# EAGLE schematic slave unit motherboard 1.31 (EAGLE 7.7.0)
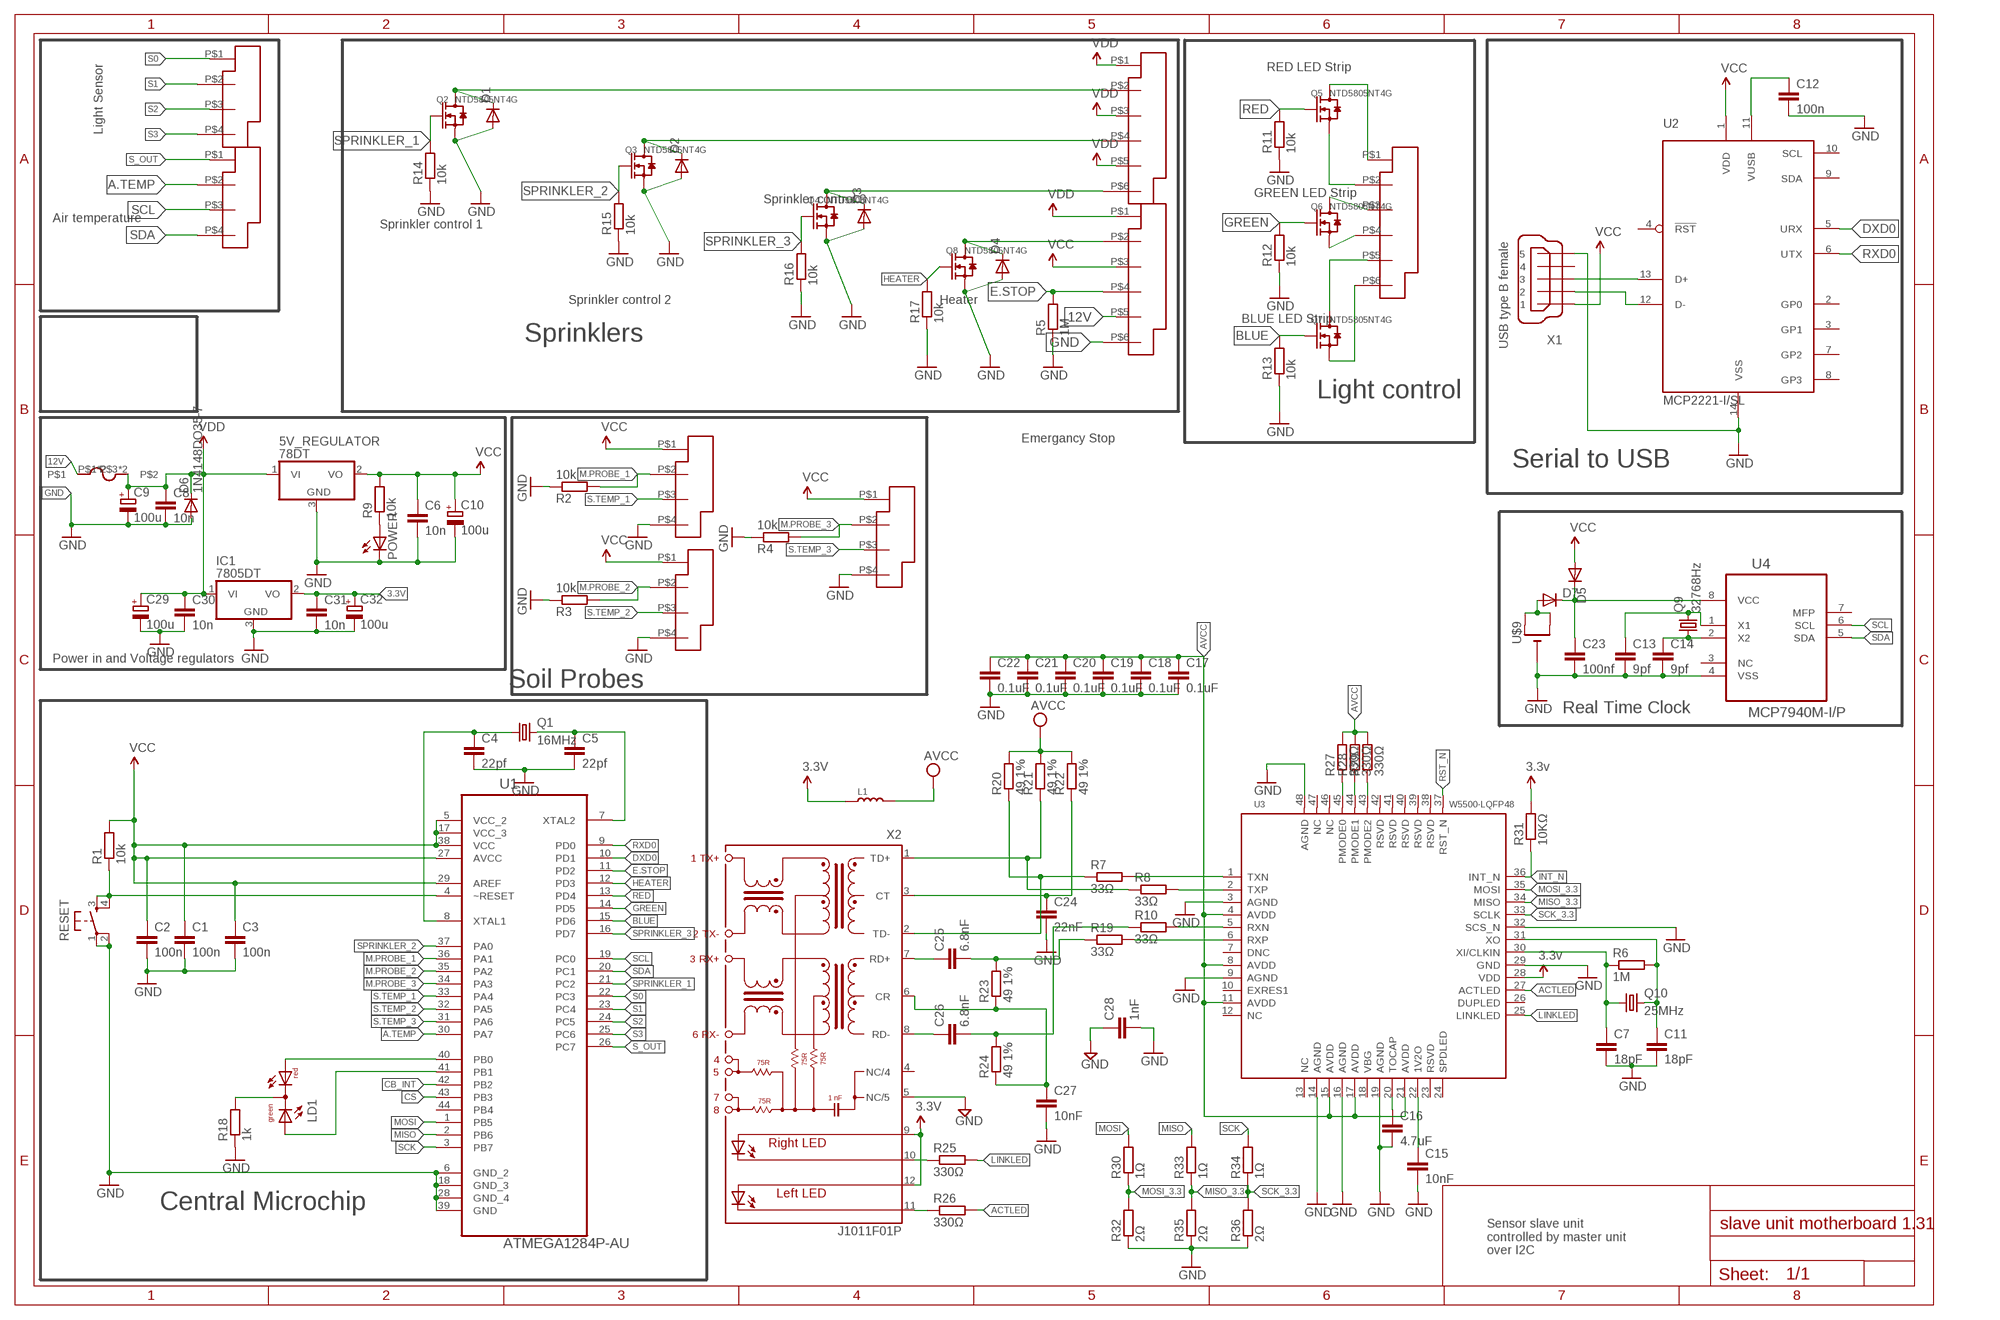
[diagram p0: schematic, sheet 1]

## Parts
5V_REGULATOR  78DT  7805DT  [TO252]
C1  100n  C-EUC0805  [C0805]
C2  100n  C-EUC0805  [C0805]
C3  100n  C-EUC0805  [C0805]
C4  22pf  C-EUC0805  [C0805]
C5  22pf  C-EUC0805  [C0805]
C6  10n  C-EUC0805  [C0805]
C7  18pF  C-EUC0805  [C0805]
C8  10n  C-EUC0805  [C0805]
C9  100u  CPOL-EUE1.8-4  [E1,8-4]
C10  100u  CPOL-EUE1.8-4  [E1,8-4]
C11  18pF  C-EUC0805  [C0805]
C12  100n  C-EUC0805  [C0805]
C13  9pf  C-EU025-024X044  [C025-024X044]
C14  9pf  C-EU025-024X044  [C025-024X044]
C15  10nF  C-EUC0805  [C0805]
C16  4.7uF  C-EUC0805  [C0805]
C17  0.1uF  C-EUC0805  [C0805]
C18  0.1uF  C-EUC0805  [C0805]
C19  0.1uF  C-EUC0805  [C0805]
C20  0.1uF  C-EUC0805  [C0805]
C21  0.1uF  C-EUC0805  [C0805]
C22  0.1uF  C-EUC0805  [C0805]
C23  100nf  C-EU025-024X044  [C025-024X044]
C24  22nF  C-EUC0805  [C0805]
C25  6.8nF  C-EUC0805  [C0805]
C26  6.8nF  C-EUC0805  [C0805]
C27  10nF  C-EUC0805  [C0805]
C28  1nF  C-EUC0805  [C0805]
C29  100u  CPOL-EUE1.8-4  [E1,8-4]
C30  10n  C-EUC0805  [C0805]
C31  10n  C-EUC0805  [C0805]
C32  100u  CPOL-EUE1.8-4  [E1,8-4]
D1  DIODE-MINIMELF  [MINIMELF]
D2  DIODE-MINIMELF  [MINIMELF]
D3  DIODE-MINIMELF  [MINIMELF]
D4  DIODE-MINIMELF  [MINIMELF]
D5  DIODE-D-2.5  [D-2.5]
D6  1N4148DO35-7  DIODE-MINIMELF  [MINIMELF]
D7  DIODE-D-2.5  [D-2.5]
IC1  7805DT  [TO252]
L1  INDUCTOR/FERRITE-BEAD'0805'  [L0805]
LD1  DUOLED-RG-C  [DUOLED-C-5MM]
LEDS1  3X2TERM  [3*2TERM]
POWER  LEDLD260  [LD260]
Q1  16MHz  CRYSTALS-NOGND-HC49  [HC49]
Q2  NTD5805NT4G  MOSFET-N  [SOT-23]
Q3  NTD5805NT4G  MOSFET-N  [SOT-23]
Q4  NTD5805NT4G  MOSFET-N  [SOT-23]
Q5  NTD5805NT4G  SMD-MOSFET-HIGH-POWER-N-CH-40V-51A-NTD5805NT4G(DPAK)  [DPAK]
Q6  NTD5805NT4G  SMD-MOSFET-HIGH-POWER-N-CH-40V-51A-NTD5805NT4G(DPAK)  [DPAK]
Q7  NTD5805NT4G  SMD-MOSFET-HIGH-POWER-N-CH-40V-51A-NTD5805NT4G(DPAK)  [DPAK]
Q8  NTD5805NT4G  MOSFET-N  [SOT-23]
Q9  32768Hz  CRYSTALTC26V  [TC26V]
Q10  25MHz  CRYSTALS-NOGND-HC49  [HC49]
R1  10k  R-EU_M0805  [M0805]
R2  10k  R-EU_M0805  [M0805]
R3  10k  R-EU_M0805  [M0805]
R4  10k  R-EU_M0805  [M0805]
R5  1M  R-EU_M0805  [M0805]
R6  1M  R-EU_M0805  [M0805]
R7  33Ω  R-EU_M0805  [M0805]
R8  33Ω  R-EU_M0805  [M0805]
R9  10k  R-EU_M0805  [M0805]
R10  33Ω  R-EU_M0805  [M0805]
R11  10k  R-EU_M0805  [M0805]
R12  10k  R-EU_M0805  [M0805]
R13  10k  R-EU_M0805  [M0805]
R14  10k  R-EU_M0805  [M0805]
R15  10k  R-EU_M0805  [M0805]
R16  10k  R-EU_M0805  [M0805]
R17  10k  R-EU_M0805  [M0805]
R18  1k  R-EU_M0805  [M0805]
R19  33Ω  R-EU_M0805  [M0805]
R20  49 1%  R-EU_M0805  [M0805]
R21  49 1%  R-EU_M0805  [M0805]
R22  49 1%  R-EU_M0805  [M0805]
R23  49 1%  R-EU_M0805  [M0805]
R24  49 1%  R-EU_M0805  [M0805]
R25  330Ω  R-EU_M0805  [M0805]
R26  330Ω  R-EU_M0805  [M0805]
R27  330Ω  R-EU_M0805  [M0805]
R28  330Ω  R-EU_M0805  [M0805]
R29  330Ω  R-EU_M0805  [M0805]
R30  1Ω  R-EU_M0805  [M0805]
R31  10KΩ  R-EU_M0805  [M0805]
R32  2Ω  R-EU_M0805  [M0805]
R33  1Ω  R-EU_M0805  [M0805]
R34  1Ω  R-EU_M0805  [M0805]
R35  2Ω  R-EU_M0805  [M0805]
R36  2Ω  R-EU_M0805  [M0805]
RESET  TACTILE-SWITCH-PTH  [TAC-SWITCH-PTH]
U1  ATMEGA1284P-AU  [QFP80P1200X1200X120-44N]
U2  MCP2221-I/SL  [SOIC14]
U3  W5500-LQFP48  INTERFACE-W5500(LQFP48)  [LQFP48-0.5-7X7MM]
U4  MCP7940M-I/P  [DIP254P762X508-8P]
U$1  520MM_FUSE_HOLDER  [2.5X5MM_FUSE_HOLDER]
U$2  2X2TERM  [2X2TERM]
U$3  2X2TERM  [2X2TERM]
U$4  2X2TERM  [2X2TERM]
U$5  3X2TERM  [3*2TERM]
U$6  3X2TERM  [3*2TERM]
U$7  2X2TERM  [2X2TERM]
U$8  2X2TERM  [2X2TERM]
U$9  CR1220THM  [CR1220-THM]
X1  USB type B female  MINI-USB_SHIELD5P4-32005-501  [32005-501]
X2  J1011F01P  [J1]

## Nets
3.3V: C31.1 C32.+ IC1.2(VO) L1.1 R31.2 U3.28(VDD) X2.9(A-R) X2.12(AL) ; supply symbol labelled 3.3v
12V: U$1.P$1 U$1.P$2 U$5.P$5
A.TEMP: U1.30(PA7) U$3.P$2
ACTLED: R26.2 U3.27(ACTLED)
AVCC: C17.1 C18.1 C19.1 C20.1 C21.1 C22.1 L1.2 R20.2 R21.2 R22.2 R27.2 R28.2 R29.2 U3.4(AVDD) U3.8(AVDD) U3.11(AVDD) U3.15(AVDD) U3.17(AVDD) U3.21(AVDD)
BLUE: Q7.1(G) R13.2 U1.15(PD6)
CB_INT: U1.42(PB2)
CS: U1.43(PB3)
DXD0: U1.10(PD1) U2.5(URX)
E.STOP: R5.2 U1.11(PD2) U$5.P$4
EGND: C28.1 X2.5(NC/5) ; supply symbol labelled GND
ERROR: LD1.AR U1.40(PB0)
GND: 5V_REGULATOR.3(GND) C1.2 C2.2 C3.2 C4.2 C5.2 C6.2 C7.2 C8.2 C9.- C10.- C11.2 C12.2 C13.2 C14.2 C15.2 C16.2 C17.2 C18.2 C19.2 C20.2 C21.2 C22.2 C23.2 C24.2 C27.2 C28.2 C29.- C30.2 C31.2 C32.- D1.A D2.A D3.A D4.A D6.A IC1.3(GND) POWER.K(C) Q2.2(S) Q3.2(S) Q4.2(S) Q8.2(S) R2.1 R3.1 R4.1 R5.1 R11.1 R12.1 R13.1 R14.1 R15.1 R16.1 R17.1 R18.1 R32.1 R35.1 R36.1 RESET.1 RESET.2 U1.6(GND_2) U1.18(GND_3) U1.28(GND_4) U1.39(GND) U2.14(VSS) U3.3(AGND) U3.9(AGND) U3.14(AGND) U3.16(AGND) U3.19(AGND) U3.29(GND) U3.48(AGND) U4.4(VSS) U$4.P$4 U$5.P$6 U$7.P$4 U$8.P$4 U$9.- X1.5
GREEN: Q6.1(G) R12.2 U1.14(PD5)
HEATER: Q8.1(G) R17.2 U1.12(PD3)
INT_N: R31.1 U3.36(INT_N)
LINKLED: R25.2 U3.25(LINKLED)
M.PROBE_1: R2.2 U1.36(PA1) U$4.P$2
M.PROBE_2: R3.2 U1.35(PA2) U$8.P$2
M.PROBE_3: R4.2 U1.34(PA3) U$7.P$2
MISO: R33.2 U1.2(PB6)
MISO_3.3: R33.1 R35.2 U3.34(MISO)
MOSI: R30.2 U1.1(PB5)
MOSI_3.3: R30.1 R32.2 U3.35(MOSI)
N$1: LEDS1.P$1 Q5.3(D)
N$2: U2.13(D+) X1.3
N$3: C4.1 Q1.1 U1.8(XTAL1)
N$4: C5.1 Q1.2 U1.7(XTAL2)
N$5: U2.12(D-) X1.2
N$6: C23.1 D5.C D7.C U4.8(VCC)
N$7: LD1.C R18.2
N$8: D7.A U$9.+1(+) U$9.+2(+1)
N$9: D3.C Q4.3(D) U$6.P$6
N$10: LEDS1.P$2 Q5.2(S)
N$11: LEDS1.P$3 Q6.3(D)
N$12: LEDS1.P$4 Q6.2(S)
N$13: LEDS1.P$5 Q7.3(D)
N$14: LEDS1.P$6 Q7.2(S)
N$15: C7.1 Q10.1 R6.1 U3.30(XI/CLKIN)
N$16: C11.1 Q10.2 R6.2 U3.31(XO)
N$17: C15.1 U3.22(1V2O)
N$18: D4.C Q8.3(D) U$5.P$2
N$19: C12.1 U2.11(VUSB)
N$20: C16.1 U3.20(TOCAP)
N$21: R7.2 U3.1(TXN)
N$22: R8.2 U3.2(TXP)
N$23: R10.2 U3.5(RXN)
N$24: R19.2 U3.6(RXP)
N$25: R7.1 R20.1 X2.2(TD-)
N$26: R8.1 R21.1 X2.1(TD+)
N$27: POWER.A R9.1
N$28: C26.2 R10.1 R24.2
N$29: C25.2 R19.1 R23.2
N$30: C24.1 R22.1 X2.3(CT)
N$31: C26.1 X2.8(RD-)
N$32: C25.1 X2.7(RD+)
N$33: C27.1 R23.1 R24.1 X2.6(CR)
N$34: R25.1 X2.10(C-R)
N$35: R26.1 X2.11(C-L)
N$36: R27.1 U3.45(PMODE0)
N$37: R28.1 U3.44(PMODE1)
N$38: R29.1 U3.43(PMODE2)
N$39: C13.1 Q9.2 U4.1(X1)
N$40: C14.1 Q9.1 U4.2(X2)
RED: Q5.1(G) R11.2 U1.13(PD4)
RESET: R1.1 RESET.3 RESET.4 U1.4(~RESET)
RST_N: U3.37(RST_N)
RUNNING: LD1.AX(AG) U1.41(PB1)
RXD0: U1.9(PD0) U2.6(UTX)
S0: U1.22(PC3) U$2.P$1
S1: U1.23(PC4) U$2.P$2
S2: U1.24(PC5) U$2.P$3
S3: U1.25(PC6) U$2.P$4
S.TEMP_1: U1.33(PA4) U$4.P$3
S.TEMP_2: U1.32(PA5) U$8.P$3
S.TEMP_3: U1.31(PA6) U$7.P$3
S_OUT: U1.26(PC7) U$3.P$1
SCK: R34.2 U1.3(PB7)
SCK_3.3: R34.1 R36.2 U3.33(SCLK)
SCL: U1.19(PC0) U4.6(SCL) U$3.P$3
SCS_N: U3.32(SCS_N) ; supply symbol labelled GND
SDA: U1.20(PC1) U4.5(SDA) U$3.P$4
SPRINKLER_1: Q2.1(G) R14.2 U1.21(PC2)
SPRINKLER_2: Q3.1(G) R15.2 U1.37(PA0)
SPRINKLER_3: Q4.1(G) R16.2 U1.16(PD7)
SPRINKLER_ONE: D1.C Q2.3(D) U$6.P$2
SPRINKLER_TWO: D2.C Q3.3(D) U$6.P$4
VCC: 5V_REGULATOR.2(VO) C1.1 C2.1 C3.1 C6.1 C10.+ D5.A R1.2 R9.2 U1.5(VCC_2) U1.17(VCC_3) U1.27(AVCC) U1.29(AREF) U1.38(VCC) U2.1(VDD) U$4.P$1 U$5.P$3 U$7.P$1 U$8.P$1 X1.1
VDD: 5V_REGULATOR.1(VI) C8.1 C9.+ C29.+ C30.1 D6.C IC1.1(VI) U$1.P$3 U$1.P$4 U$5.P$1 U$6.P$1 U$6.P$3 U$6.P$5
Unconnected: U1.44(PB4) U2.2(GP0) U2.3(GP1) U2.4(!RST) U2.7(GP2) U2.8(GP3) U2.9(SDA) U2.10(SCL) U3.7(DNC) U3.10(EXRES1) U3.12(NC) U3.13(NC) U3.18(VBG) U3.23(RSVD) U3.24(SPDLED) U3.26(DUPLED) U3.38(RSVD) U3.39(RSVD) U3.40(RSVD) U3.41(RSVD) U3.42(RSVD) U3.46(NC) U3.47(NC) U4.3(NC) U4.7(MFP) X1.4 X1.M1(S1) X1.M2(S2) X1.M3(S3) X1.M4(S4) X2.4(NC/4)

## Notes on the sheet
- RED LED Strip
- Light Sensor
- GREEN LED Strip
- Sprinkler control 3
- Air temperature
- Sprinkler control 1
- Sprinkler control 2 | Heater
- BLUE LED Strip
- Sprinklers
- Light control
- Emergancy Stop
- Serial to USB
- Power in and Voltage regulators
- Soil Probes
- Real Time Clock
- Central Microchip
- Sensor slave unit 
  controlled by master unit
  over I2C

## Library data of the parts
5V_REGULATOR IC1 = linear:78*: Positive VOLTAGE REGULATOR Source: http://cache.national.com/ds/LM/LM78L05.pdf http://www.fairchildsemi.com/ds/LM/LM7805.pdf
C1-C8 C11-C28 C30 C31 = rcl:C-EU: CAPACITOR, European symbol
C9 C10 C29 C32 = rcl:CPOL-EU: POLARIZED CAPACITOR, European symbol
D1-D7 = diode:DIODE-: DIODE
L1 = Seeed-OPL-Inductor:INDUCTOR/FERRITE-BEAD
LD1 = led:DUOLED-RG-C: DUO LED 2 colors (red/green), 5 mm, round, common Cathode www.ligitek.com or other producers.
LEDS1 U$5 U$6 = Edward custom parts:3X2TERM
POWER = adafruit:LED: LED OSRAM: - CHIPLED LG R971, LG N971, LY N971, LG Q971, LY Q971, LO R971, LY R971 LH N974, LH R974 LS Q976, LO Q976, LY Q976 LO Q996 - Hyper CHIPLED LW Q18S LB Q993, LB Q99A, LB R99A - SideLED LS A670, LO A670, LY A670, LG A670, LP A670 LB A673, LV A673, LT A673, LW A673 LH A674 LY A675 LS A676, LA A676, LO A676, LY A676, LW A676 LS A679, LY A679, LG A679 - Hyper Micro SIDELED® LS Y876, LA Y876, LO Y876, LY Y876 LT Y87S - SmartLED LW L88C, LW L88S LB L89C, LB L89S, LG L890 LS L89K, LO L89K, LY L89K LS L896, LA L896, LO L896, LY L896 - TOPLED LS T670, LO T670, LY T670, LG T670, LP T670 LSG T670, LSP T670, LSY T670, LOP T670, LYG T670 LG T671, LOG T671, LSG T671 LB T673, LV T673, LT T673, LW T673 LH T674 LS T676, LA T676, LO T676, LY T676, LB T676, LH T676, LSB T676, LW T676 LB T67C, LV T67C, LT T67C, LS T67K, LO T67K, LY T67K, LW E67C LS E67B, LA E67B, LO E67B, LY E67B, LB E67C, LV E67C, LT E67C LW T67C LS T679, LY T679, LG T679 LS T770, LO T770, LY T770, LG T770, LP T770 LB T773, LV T773, LT T773, LW T773 LH T774 LS E675, LA E675, LY E675, LS T675 LS T776, LA T776, LO T776, LY T776, LB T776 LHGB T686 LT T68C, LB T68C - Hyper Mini TOPLED® LB M676 - Mini TOPLED Santana® LG M470 LS M47K, LO M47K, LY M47K Source: http://www.osram.convergy.de/
Q1 Q10 = IQD-Frequency-Products:CRYSTALS-NOGND: CRYSTALS CAN NOT GROUNDED
Q2-Q4 Q8 = Seeed-OPL-Transistor:MOSFET-N
Q5-Q7 = Seeed-OPL-Transistor:SMD-MOSFET-HIGH-POWER-N-CH-40V-51A-NTD5805NT4G(DPAK): 305030078; MPN: NTD5805NT4G
Q9 = adafruit:CRYSTAL: CRYSTAL; OC_FARNELL: unknown; OC_NEWARK: unknown
R1-R36 = rcl:R-EU_: RESISTOR, European symbol
RESET = GeekAmmo:TACTILE-SWITCH: Tactile Switch 4 Pins, SPST NO
U1 = Atmel_By_element14_Batch_1-00:ATMEGA1284P-AU: Microcontroller with Programmable Flash; MPN: ATMEGA1284P-AU; OC_FARNELL: 1715480; OC_NEWARK: 15R0263; PACKAGE: TQFP-44; SUPPLIER: Atmel
U2 = microchip-mcp2221:MCP2221-*: MCP2221 in PDIP, SOIC and TSSOP package The MCP2221 is a USB-to-UART/I2C serial converter which enables USB connectivity in applications that have a UART and I2C interfaces. The device reduces external components by integrating the USB termination resistors and the oscillator needed for USB operation. The MCP2221 also has four GP pins providing miscellaneous functionalities (GPIO, USBCFG, SSPND, Clock Output, ADC, DAC, interrupt detector). Source: www.microchip.com/MCP2221 <http://www.microchip.com/wwwproducts/Devices.aspx?product=MCP2221> and www.microchipdirect.com <http://www.microchipdirect.com/ProductDetails.aspx?Category=MCP2221> Tutorial: MCP2221 by Arnauld Biganzoli <https://docs.google.com/document/d/1P3zzqCKdEXzCe--1Yyg8PClCZKsUri8pyNO7AV2daaw/edit?usp=sharing>
U3 = Seeed-OPL-ic:INTERFACE-W5500(LQFP48): 310070032; MPN: W5500
U4 = MCP7940M-I:MCP7940M-I/P: RTC, I2C, 64BYTES SRAM, 8PDIP; MPN: MCP7940M-I/P; OC_FARNELL: 2098894; OC_NEWARK: 94T7491; PACKAGE: PDIP-8; SUPPLIER: Microchip
U$1 = Edward custom parts:5*20MM_FUSE_HOLDER: 5*20mm Fuse holder in two parts
U$2-U$4 U$7 U$8 = Edward custom parts:2X2TERM
U$9 = adafruit:CR1220: CR1216/CR1220/CR1225 12mm 3V lithium coin cell Great for battery packup. Both SMT and THM holders. Note the THM package has the ground pads on both sides of the PCB so that the masks are the same - this reduces the cost
X1 = con-cypressindustries:MINI-USB_SHIELD5P4-: MINI USB-B R/A W/O POST 5 pol. Source: www.cypressindustries.com; OC_FARNELL: unknown; OC_NEWARK: unknown
X2 = con-pulse:J1011F: PULSEJACK (TM) 1x1 Tab-UP RJ45 10/100 Base-TX RJ45 1x1 Tab-UP with LEDs 8-pin (J1 series) and 6-pin (JP series) integrated magnetics connector, designed to support applications, such as ADSL modems, LAN-on-Motherboard, and Hub and Switches. Source: www.pulseeng.com .. PulseJack-J402.pdf; OC_FARNELL: unknown; OC_NEWARK: unknown